# Altium schematic sheet Development_Kit.SchDoc
size A3; Organization: Crocca Boards; Address1: Via Lippi 9; Address2: 40026 Imola; Address3: Bologna; Address4: Italy

## Notes on the sheet
- Ver.
- REVISION
- DRAWN
- CHECK
- Title
- Size:
- Date:
- A3
- Number:
- Time:
- Revision:
- Sheet
- of
- File: